# Altium schematic sheet SCH_interface_cmv4000-de2.SchDoc
size A4
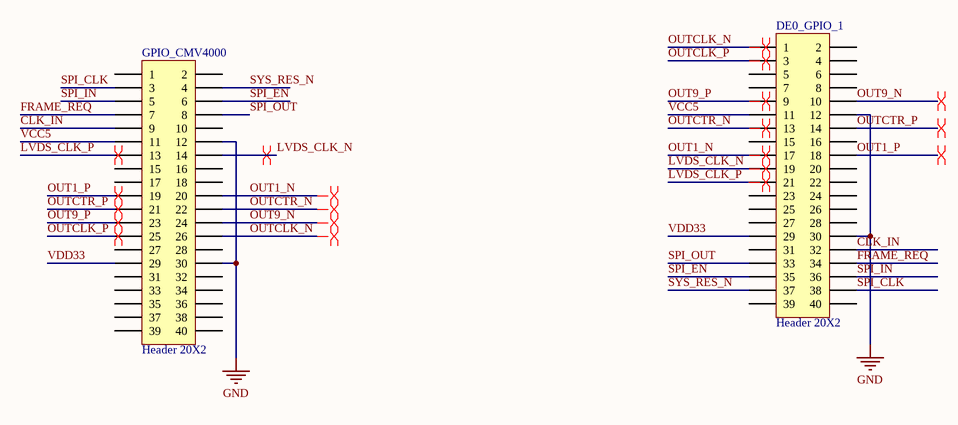
[diagram p0: SCH_interface_cmv4000-de2.SchDoc]

## Parts
DE0_GPIO_1  Header 20X2  [HDR2X20]
GPIO_CMV4000  Header 20X2  [HDR2X20]

## Nets
GND: DE0_GPIO_1.12 DE0_GPIO_1.30 GPIO_CMV4000.12 GPIO_CMV4000.30
CLK_IN: DE0_GPIO_1.32 GPIO_CMV4000.9
FRAME_REQ: DE0_GPIO_1.34 GPIO_CMV4000.7
LVDS_CLK_N: DE0_GPIO_1.19 GPIO_CMV4000.14
LVDS_CLK_P: DE0_GPIO_1.21 GPIO_CMV4000.13
OUT1_N: DE0_GPIO_1.17 GPIO_CMV4000.20
OUT1_P: DE0_GPIO_1.18 GPIO_CMV4000.19
OUT9_N: DE0_GPIO_1.10 GPIO_CMV4000.24
OUT9_P: DE0_GPIO_1.9 GPIO_CMV4000.23
OUTCLK_N: DE0_GPIO_1.1 GPIO_CMV4000.26
OUTCLK_P: DE0_GPIO_1.3 GPIO_CMV4000.25
OUTCTR_N: DE0_GPIO_1.13 GPIO_CMV4000.22
OUTCTR_P: DE0_GPIO_1.14 GPIO_CMV4000.21
SPI_CLK: DE0_GPIO_1.38 GPIO_CMV4000.3
SPI_EN: DE0_GPIO_1.35 GPIO_CMV4000.6
SPI_IN: DE0_GPIO_1.36 GPIO_CMV4000.5
SPI_OUT: DE0_GPIO_1.33 GPIO_CMV4000.8
SYS_RES_N: DE0_GPIO_1.37 GPIO_CMV4000.4
VCC5: DE0_GPIO_1.11 GPIO_CMV4000.11
VDD33: DE0_GPIO_1.29 GPIO_CMV4000.29

Not connected (* = marked no-connect by the designer): DE0_GPIO_1 2 4 5 6 7 8 15 16 20 22 23 24 25 26 27 28 31 39 40; GPIO_CMV4000 1 2 10 15 16 17 18 27 28 31 32 33 34 35 36 37 38 39 40

## Layout directives
differential pair: LVDS_CLK_N, LVDS_CLK_P, OUT1_N, OUT1_P, OUT9_N, OUT9_P, OUTCLK_N, OUTCLK_P, OUTCTR_N, OUTCTR_P

## Library data of the parts
DE0_GPIO_1 GPIO_CMV4000 = Header 20X2: Header, 20-Pin, Dual row; LatestRevisionDate: 17-Jul-2002; LatestRevisionNote: Re-released for DXP Platform.; Publisher: Altium Limited